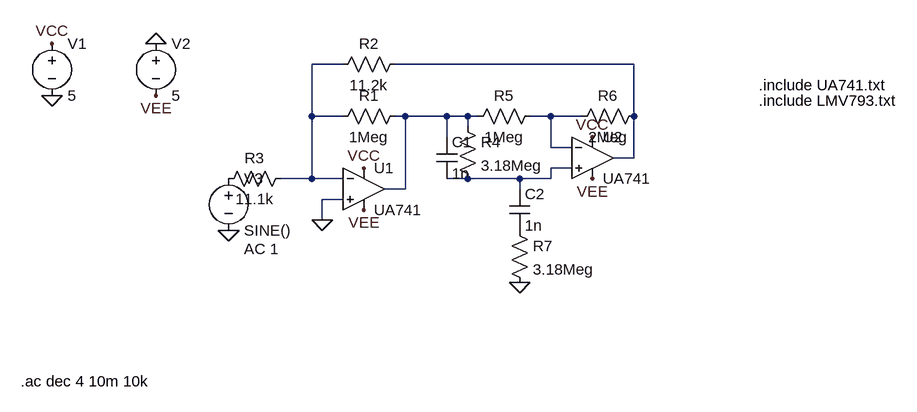
[diagram p0: schematic Bandstop-wein.asc]
Bandstop-wein.asc, the LTspice schematic file:
Version 4
SHEET 1 884 680
WIRE 0 -208 -48 -208
WIRE 448 -208 80 -208
WIRE -48 -128 -48 -208
WIRE 0 -128 -48 -128
WIRE 96 -128 80 -128
WIRE 160 -128 96 -128
WIRE 192 -128 160 -128
WIRE 208 -128 192 -128
WIRE 320 -128 288 -128
WIRE 368 -128 320 -128
WIRE 448 -128 448 -208
WIRE 192 -112 192 -128
WIRE 160 -96 160 -128
WIRE 320 -80 320 -128
WIRE 352 -80 320 -80
WIRE 448 -64 448 -128
WIRE 448 -64 416 -64
WIRE 352 -48 320 -48
WIRE -48 -32 -48 -128
WIRE -48 -32 -96 -32
WIRE 0 -32 -48 -32
WIRE 192 -32 160 -32
WIRE 272 -32 192 -32
WIRE 320 -32 320 -48
WIRE 320 -32 272 -32
WIRE 96 -16 96 -128
WIRE 96 -16 64 -16
WIRE 272 -16 272 -32
WIRE 0 0 -32 0
WIRE -32 32 -32 0
FLAG -448 -240 VCC
FLAG -288 -160 VEE
FLAG -448 -160 0
FLAG -288 -240 0
FLAG 32 -48 VCC
FLAG -32 32 0
FLAG 272 128 0
FLAG 384 -96 VCC
FLAG 32 16 VEE
FLAG 384 -32 VEE
FLAG -176 48 0
SYMBOL voltage -448 -256 R0
WINDOW 123 0 0 Left 0
WINDOW 39 0 0 Left 0
SYMATTR InstName V1
SYMATTR Value 5
SYMBOL voltage -288 -256 R0
WINDOW 123 0 0 Left 0
WINDOW 39 0 0 Left 0
SYMATTR InstName V2
SYMATTR Value 5
SYMBOL Opamps\\opamp2 32 -80 R0
SYMATTR InstName U1
SYMATTR Value UA741
SYMBOL res 96 -144 R90
WINDOW 0 0 56 VBottom 2
WINDOW 3 32 56 VTop 2
SYMATTR InstName R1
SYMATTR Value 1Meg
SYMBOL res 96 -224 R90
WINDOW 0 0 56 VBottom 2
WINDOW 3 32 56 VTop 2
SYMATTR InstName R2
SYMATTR Value 11.2k
SYMBOL res -80 -48 R90
WINDOW 0 0 56 VBottom 2
WINDOW 3 32 56 VTop 2
SYMATTR InstName R3
SYMATTR Value 11.1k
SYMBOL cap 144 -96 R0
SYMATTR InstName C1
SYMATTR Value 1n
SYMBOL res 176 -128 R0
SYMATTR InstName R4
SYMATTR Value 3.18Meg
SYMBOL res 304 -144 R90
WINDOW 0 0 56 VBottom 2
WINDOW 3 32 56 VTop 2
SYMATTR InstName R5
SYMATTR Value 1Meg
SYMBOL Opamps\\opamp2 384 -128 R0
SYMATTR InstName U2
SYMATTR Value UA741
SYMBOL res 464 -144 R90
WINDOW 0 0 56 VBottom 2
WINDOW 3 32 56 VTop 2
SYMATTR InstName R6
SYMATTR Value 2Meg
SYMBOL cap 256 -16 R0
SYMATTR InstName C2
SYMATTR Value 1n
SYMBOL res 256 32 R0
SYMATTR InstName R7
SYMATTR Value 3.18Meg
SYMBOL voltage -176 -48 R0
WINDOW 123 24 124 Left 2
WINDOW 39 0 0 Left 0
SYMATTR InstName V3
SYMATTR Value SINE()
SYMATTR Value2 AC 1
TEXT 640 -176 Left 2 !.include UA741.txt
TEXT 640 -152 Left 2 !.include LMV793.txt
TEXT -496 280 Left 2 !.ac dec 4 10m 10k

The netlist it stands for:
* Bandstop-wein.asc
V1 VCC 0 5
V2 0 VEE 5
XU1 0 N001 VCC VEE N003 UA741  ; pins In+ In- V+ V- OUT
R1 N003 N001 1Meg
R2 N002 N001 11.2k
R3 N001 P001 11.1k
C1 N003 N005 1n
R4 N003 N005 3.18Meg
R5 N004 N003 1Meg
XU2 N005 N004 VCC VEE N002 UA741  ; pins In+ In- V+ V- OUT
R6 N002 N004 2Meg
C2 N005 P002 1n
R7 P002 0 3.18Meg
V3 P001 0 SINE() AC 1
.include UA741.txt
.include LMV793.txt
.ac dec 4 10m 10k
.backanno
.end